# Altium schematic sheet CAN.SchDoc
size A4; SheetNumber: 3; SheetTotal: 8
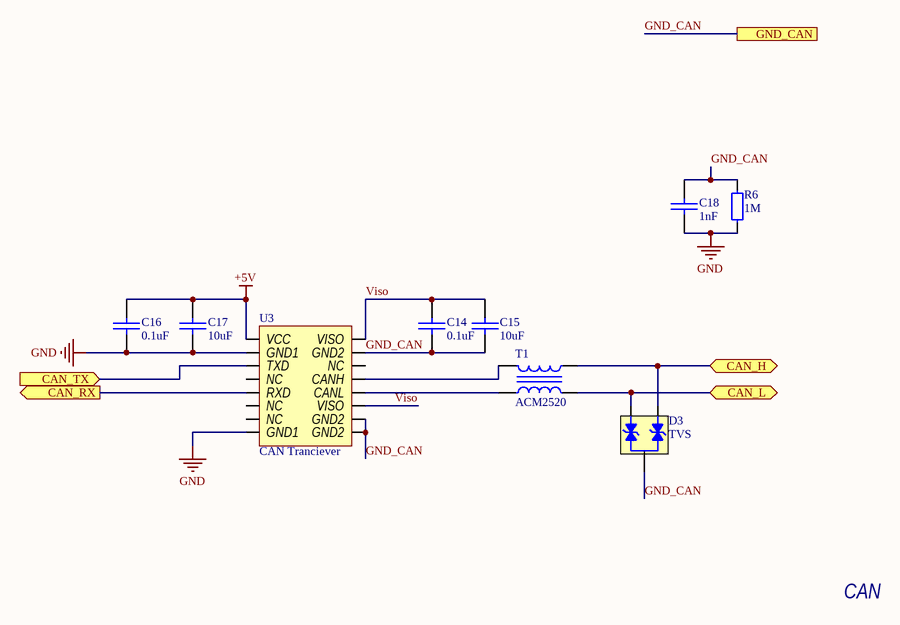
[diagram p0: CAN.SchDoc]

## Parts
C14  0.1uF  [0603 Capicator]
C15  10uF  [0603 Capicator]
C16  0.1uF  [0603 Capicator]
C17  10uF  [0603 Capicator]
C18  1nF  [0603 Capicator]
D3  TVS  [SOT-23]
R6  1M  [0603 Resistor]
T1  ACM2520  [ACM2520]
U3  CAN Tranciever  [SOIC16W]

## Ports
CAN_H (bidir), CAN_L (bidir), CAN_RX (out), CAN_TX (in), GND_CAN

## Nets
+5V: C16.2 C17.2 U3.1(VCC)
GND: C16.1 C17.1 C18.1 R6.1 U3.2(GND1) U3.8(GND1)
CAN_H: D3.1 T1.2 ; port CAN_H
CAN_L: D3.2 T1.4 ; port CAN_L
CAN_RX: U3.5(RXD) ; port CAN_RX
CAN_TX: U3.3(TXD) ; port CAN_TX
GND_CAN: C14.1 C15.1 C18.2 D3.3 R6.2 U3.9(GND2) U3.10(GND2) U3.15(GND2) ; port GND_CAN
Viso: C14.2 C15.2 U3.11(VISO) U3.16(VISO)
NetT1_1: T1.1 U3.13(CANH)
NetT1_3: T1.3 U3.12(CANL)

Not connected (* = marked no-connect by the designer): U3 4(NC) 6(NC) 7(NC) 14(NC)

## Notes on the sheet
- CAN

## Library data of the parts
C14 C16 = Cap 0.1uF (0603): 0.1uF X7R 16V 10% 0603; Manufacturer: Murata Manufacturing; Part Number: GRM188R71C104KA01D; Type: Capacitor; ComponentLink1Description: Chip&Dip; ComponentLink1URL: https://www.chipdip.ru/product/grm188r71c104ka01d
C15 C17 = Cap 10uF (0603): 10uF X5R 25V 20% 0603; Manufacturer: Murata Manufacturing; Part Number: GRM188R61E106M; Type: Capacitor; ComponentLink1Description: Chip&Dip; ComponentLink1URL: https://www.chipdip.ru/product/grm188r61e106m
C18 = Cap 1nF (0603): X7R 1nF 100V 10% 0603; Manufacturer: Murata Manufacturing; Part Number: GRM188R72A102KA01D; Type: Capacitor; ComponentLink1Description: Chip&Dip; ComponentLink1URL: https://www.chipdip.ru/product/grm188r72a102ka01d
D3 = TVS Diode Arrays: The SM24CANB TVS Diode Array is designed to protect automotive Controller Area Network (CAN) lines from damage due to electrostatic discharge (ESD), electrical fast transient (EFT), and other overvoltage transients.; Part Number: SM24CANB-02HTG; Manufacturer: Littelfuse; Type: Diode; ComponentLink1Description: DataSheet; ComponentLink1URL: https://m.littelfuse.com/~/media/electronics/datasheets/tvs_diode_arrays/littelfuse_tvs_diode_array_sm24canb_datasheet.pdf.pdf; ComponentLink2Description: Chip&Dip; ComponentLink2URL: https://www.chipdip.ru/product1/8001779022
R6 = Res 1M (0603): 0.1W 0603 1M, 1%; Part Number: RC0603FR-071ML; Manufacturer: Taiwan; Type: Resistor; ComponentLink1Description: Chip&Dip; ComponentLink1URL: https://www.chipdip.ru/product0/9000079784
T1 = ACM2520: Common mode filters / Automotive signal line (for power train/safety); Manufacturer: TDK; Part Number: ACM2520-301-2P-T002; Type: Inductor; ComponentLink1Description: DataSheet; ComponentLink1URL: https://product.tdk.com/system/files/dam/doc/product/emc/emc/cmf_cmc/catalog/cmf_commercial_signal_acm2520_en.pdf; ComponentLink2Description: ChipDip; ComponentLink2URL: https://www.chipdip.ru/product0/8008480337?ysclid=lw4t4jsj9a923851487
U3 = TDA51SCANHC: Isolated CAN Tranciever; Manufacturer: Mornsun Power; Type: IC; Part Number: TDA51SCANHC; ComponentLink1Description: ChipDip; ComponentLink1URL: https://www.chipdip.ru/product0/8024219767; ComponentLink2Description: Datasheet; ComponentLink2URL: https://static.chipdip.ru/lib/623/DOC041623283.pdf